# EAGLE design RAK3172_board (EAGLE 9.6.2)
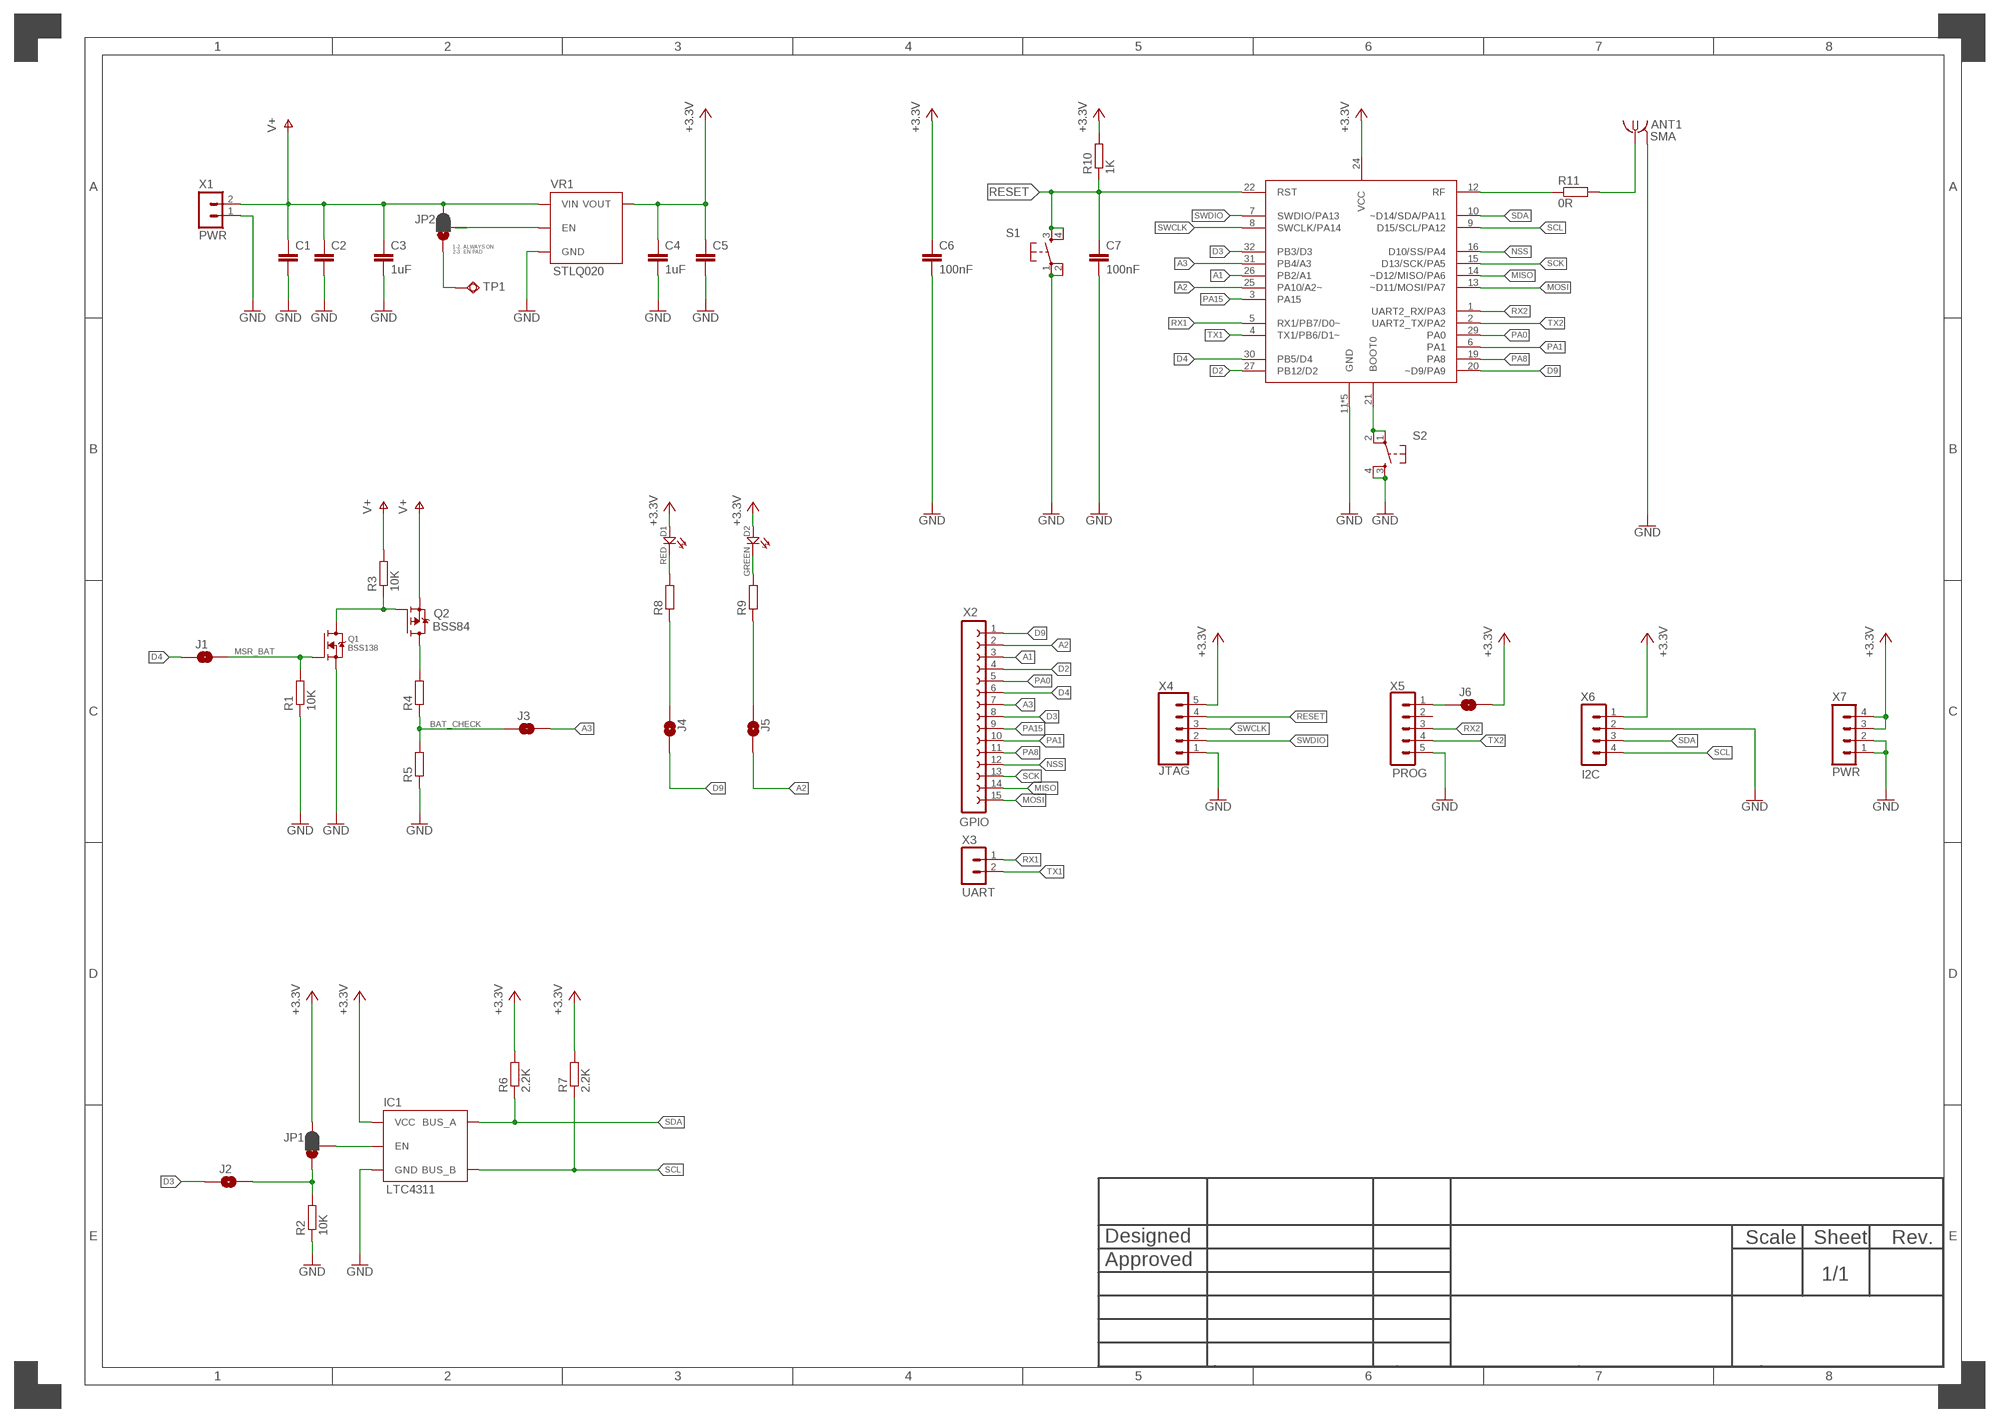
[diagram p0: schematic, sheet 1]

## Parts
ANT1  SMA  [SMA_1MM]
C1  CAP_CERAMIC_0603  [SMD_0603C]
C2  CAP_CERAMIC_0603  [SMD_0603C]
C3  1uF  CAP_CERAMIC_0603  [SMD_0603C]
C4  1uF  CAP_CERAMIC_0603  [SMD_0603C]
C5  CAP_CERAMIC_0603  [SMD_0603C]
C6  100nF  CAP_CERAMIC_0603  [SMD_0603C]
C7  100nF  CAP_CERAMIC_0603  [SMD_0603C]
D1  RED  LED0805  [LED-0805]
D2  GREEN  LED0805  [LED-0805]
IC1  LTC4311  [SC-70-6]
IC2  RAK3172HF  [RAK3172]
J1  SMD_JUMP_2_NO_N  [SMT_JUMP_2_NO]
J2  SMD_JUMP_2_NO_N  [SMT_JUMP_2_NO]
J3  SMD_JUMP_2_NO_N  [SMT_JUMP_2_NO]
J4  SMD_JUMP_2_NO_N  [SMT_JUMP_2_NO]
J5  SMD_JUMP_2_NO_N  [SMT_JUMP_2_NO]
J6  SMD_JUMP_2_NO_N  [SMT_JUMP_2_NO]
JP1  JUMPER-SMT_3_1-NC_PASTE_SILK  [SMT-JUMPER_3_1-NC_PASTE_SILK]
JP2  JUMPER-SMT_3_1-NC_PASTE_SILK  [SMT-JUMPER_3_1-NC_PASTE_SILK]
Q1  BSS138  [SOT-23-3]
Q2  BSS84  [SOT-23-3]
R1  10K  RESISTOR_0603  [SMD_0603]
R2  10K  RESISTOR_0603  [SMD_0603]
R3  10K  RESISTOR_0603  [SMD_0603]
R4  RESISTOR_0603  [SMD_0603]
R5  RESISTOR_0603  [SMD_0603]
R6  2.2K  RESISTOR_0603  [SMD_0603]
R7  2.2K  RESISTOR_0603  [SMD_0603]
R8  RESISTOR_0603  [SMD_0603]
R9  RESISTOR_0603  [SMD_0603]
R10  1K  RESISTOR_0603  [SMD_0603]
R11  0R  RESISTOR_0603  [SMD_0603]
S1  BTNRKB2  [RKB2]
S2  BTNRKB2  [RKB2]
TP1  PAD1.5X3.0  [PAD1.5X3.0]
VR1  STLQ020  [SOT323-5L]
X1  PWR  JST02_PH_H  [JST-PH_2]
X2  GPIO  CONN_15  [1X15]
X3  UART  CONN_02  [1X02]
X4  JTAG  CONN_05LOCK  [1X05_LOCK]
X5  PROG  JST05_2  [JST05_2MM]
X6  I2C  JST04_PH  [JST-PH_4]
X7  PWR  CONN_02X2  [2X02]

## Nets
+3V3: C4.1 C5.1 C6.1 D1.+ D2.+ IC1.P1(VCC) IC2.24(VCC) J6.2 JP1.3 R6.2 R7.2 R10.2 VR1.P$5(VOUT) X4.5 X6.1 X7.3 X7.4 ; supply symbol labelled +3.3V
A1: IC2.26(PB2/A1) X2.3
A2: IC2.25(PA10/A2~) J5.2 X2.2
A3: IC2.31(PB4/A3) J3.2 X2.7
AS: J4.1 R8.1
BAT_CHECK: J3.1 R4.1 R5.2
D2: IC2.27(PB12/D2) X2.4
D3: IC2.32(PB3/D3) J2.1 X2.8
D4: IC2.30(PB5/D4) J1.1 X2.6
D9: IC2.20(~D9/PA9) J4.2 X2.1
GND/2: ANT1.G@1(GND) ANT1.G@2(GND) ANT1.G@3(GND) ANT1.G@4(GND) C1.2 C2.2 C3.2 C4.2 C5.2 C6.2 C7.2 IC1.P2(GND) IC1.P5(GND) IC2.11(GND) IC2.17(GND) IC2.18(GND) IC2.23(GND) IC2.28(GND) Q1.2(S) R1.1 R2.1 R5.1 S1.1(P) S1.2(P1) S2.3(S) S2.4(S1) VR1.P$2(GND) X1.1 X4.1 X5.5 X6.2 X7.1 X7.2 ; supply symbol labelled GND
MISO: IC2.14(~D12/MISO/PA6) X2.14
MOSI: IC2.13(~D11/MOSI/PA7) X2.15
MSR_BAT: J1.2 Q1.1(G) R1.2
N$1: IC2.12(RF) R11.1
N$2: IC2.21(BOOT0) S2.1(P) S2.2(P1)
N$3: ANT1.1 R11.2
N$4: J6.1 X5.1
N$5: JP2.2 VR1.P$3(EN)
N$6: JP2.1 TP1.P$1
N$7: Q1.3(D) Q2.1(G) R3.1
N$8: D1.- R8.2
N$10: J2.2 JP1.1 R2.2
N$11: D2.- R9.2
N$12: Q2.3(D) R4.2
N$13: IC1.P3(EN) JP1.2
NSS: IC2.16(D10/SS/PA4) X2.12
PA0: IC2.29(PA0) X2.5
PA1: IC2.6(PA1) X2.10
PA8: IC2.19(PA8) X2.11
PA15: IC2.3(PA15) X2.9
QGWEG: J5.1 R9.1
RESET: C7.1 IC2.22(RST) R10.1 S1.3(S) S1.4(S1) X4.4
RX1: IC2.5(RX1/PB7/D0~) X3.1
RX2: IC2.1(UART2_RX/PA3) X5.3
SCK: IC2.15(D13/SCK/PA5) X2.13
SCL: IC1.P6(BUS_B) IC2.9(D15/SCL/PA12) R7.1 X6.4
SDA: IC1.P4(BUS_A) IC2.10(~D14/SDA/PA11) R6.1 X6.3
SWCLK: IC2.8(SWCLK/PA14) X4.3
SWDIO: IC2.7(SWDIO/PA13) X4.2
TX1: IC2.4(TX1/PB6/D1~) X3.2
TX2: IC2.2(UART2_TX/PA2) X5.4
V+: C1.1 C2.1 C3.1 JP2.3 Q2.2(S) R3.2 VR1.P$1(VIN) X1.2
Unconnected: X5.2

## Notes on the sheet
- 1-2: ALWAYS ON
  2-3: EN PAD

## Library data of the parts
ANT1 = RAK3172_board:SMA
C1-C7 = RAK3172_board:CAP_CERAMIC_*
D1 D2 = RAK3172_board:LED
IC1 = RAK3172_board:LTC4311
IC2 = RAK3172_board:RAK3172: RAK4260 LoRaWAN module from RAKwireless.
J1-J6 = RAK3172_board:SMD_JUMP_2_NO_
JP1 JP2 = RAK3172_board:JUMPER-SMT_3_1-NC_PASTE: Normally closed solder jumper (1 of 2 connections) This jumper has an aperture in the stencil to allow solder paste to bridge one of the two connections. One connection is normally closed (NC), while the other is normally open (NO). Wick off the solder to open the connection. Reapply solder to reclose the connection. Apply solder to the other side instead to change the current path.
Q1 = RAK3172_board:BSS138
Q2 = RAK3172_board:BSS84
R1-R11 = RAK3172_board:RESISTOR_*
S1 S2 = RAK3172_board:BTN
TP1 = RAK3172_board:PAD1.5X3.0
VR1 = RAK3172_board:STLQ020
X1 = RAK3172_board:JST02_*
X2 = RAK3172_board:CONN_15: FEMALE HEADER; OC_FARNELL: unknown; OC_NEWARK: unknown
X3 = RAK3172_board:CONN_02
X4 = RAK3172_board:CONN_05
X5 = RAK3172_board:JST05_*
X6 = RAK3172_board:JST04_*
X7 = RAK3172_board:CONN_02X2

## Board
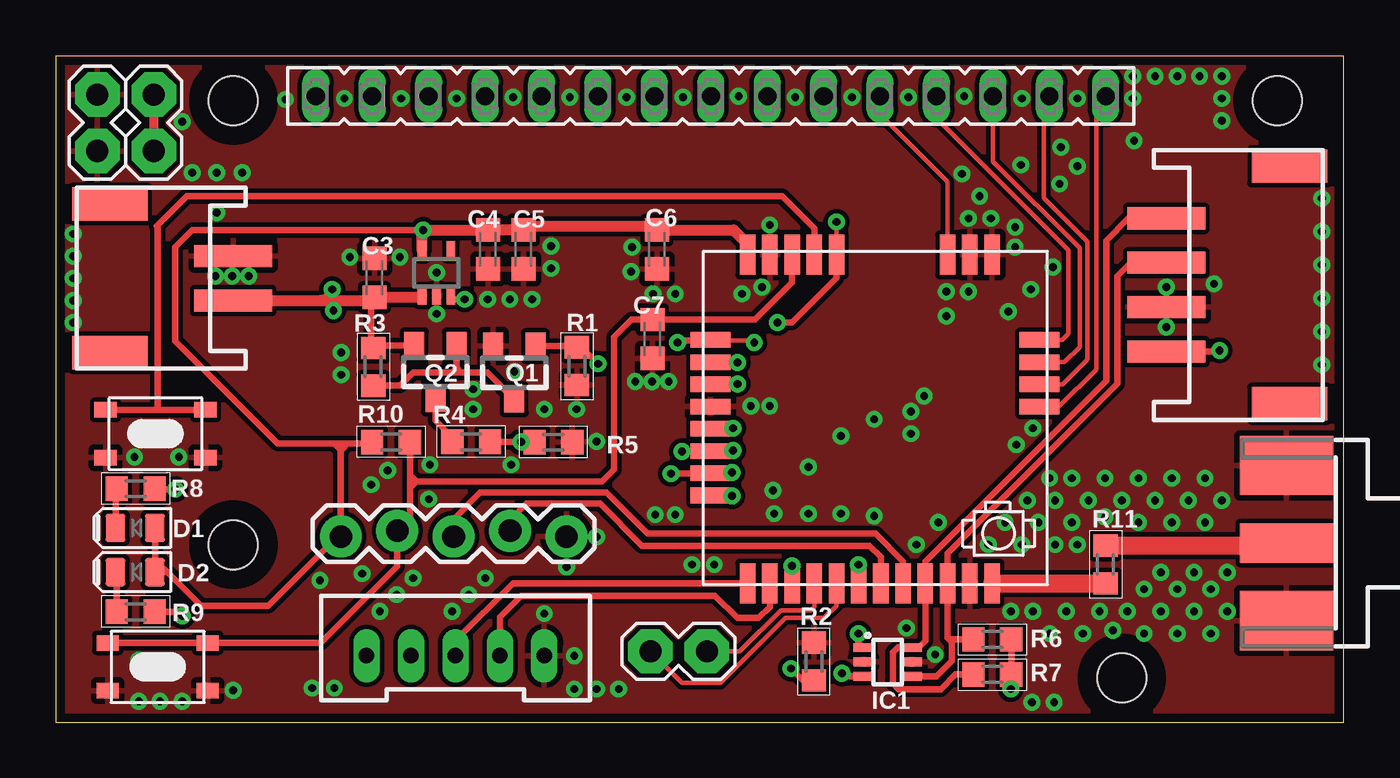
[diagram p1: board, top side]
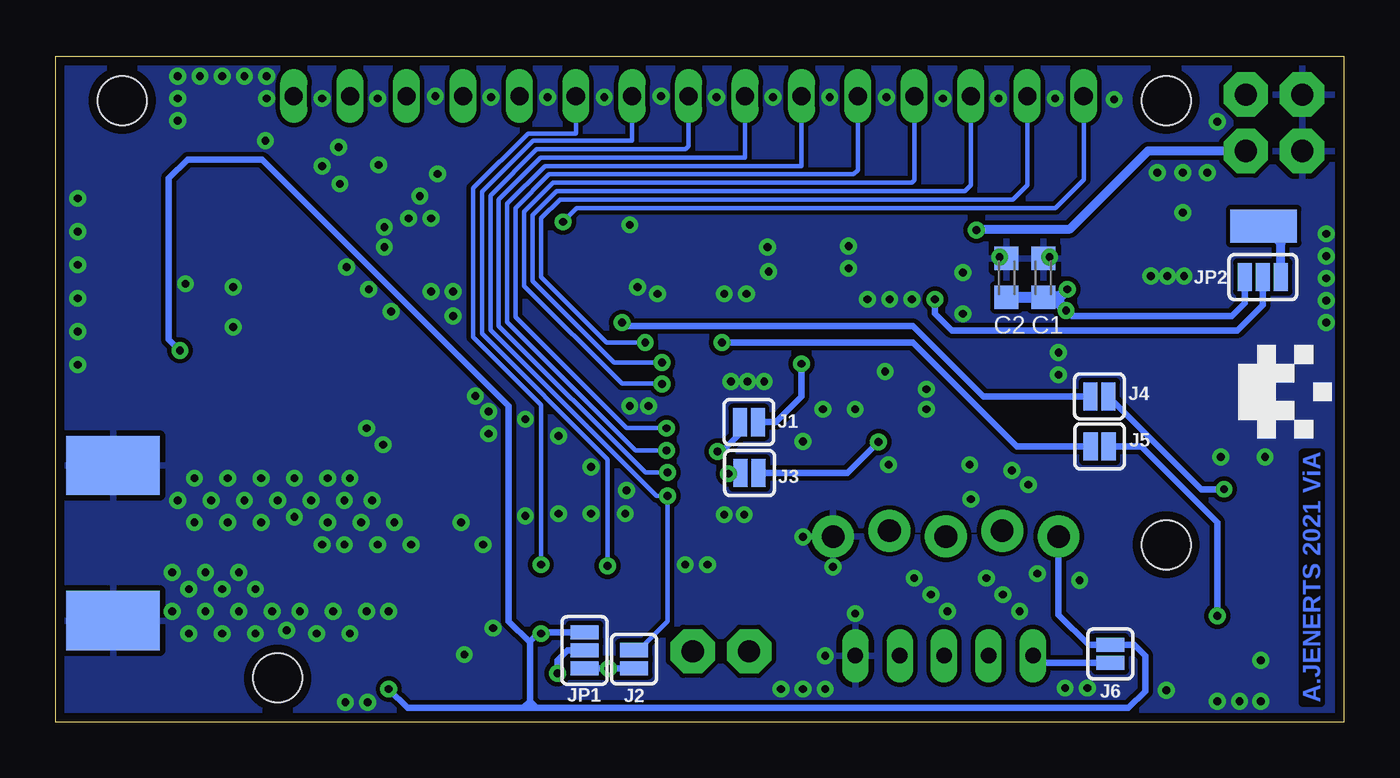
[diagram p2: board, bottom side, seen from below]

Size 58 x 30 mm. Coordinates in mm from the lower left corner, seen from the top.
Outline: 0,0 58,0 58,30 0,30 0,0
Copper layers (1*16): Top 0.035mm / dielectric 1.5mm / Bottom 0.035mm
Design rules "2layer_JLCPCB_2021_02": minimum track width 5mil, minimum drill 0.2mm, track to track 5mil, track to pad 0.2mm, pad to pad 5mil, via to via 0.2mm, smd to smd 0mil, copper to edge 0.4mm, drill to drill 10mil, minimum pad ring 3mil, minimum via ring 8mil, stop-mask expansion 4mil, vias tented up to drill 0.35mm, thermal gap 10mil
Holes 2.2 mm at 8,8 8,28 55,28 48,2
tRestrict: area 6.2,6.2 to 9.8,9.8; area 6.2,26.2 to 9.8,29.8; area 53.2,26.2 to 56.8,29.8; area 46.2,0.2 to 49.8,3.8

### Footprints (pad centres in the part's own frame; a part is rotated, then mirrored left to right if it is on the bottom)
SMA_1MM = smd 4.191 x 1.778: 1 2.115,0 | smd 4.191 x 2.667: G@1 2.115,3.495; G@2 2.115,-3.495 | smd 4.191 x 2.667 bottom: G@3 2.115,3.495; G@4 2.115,-3.495
SMD_0603C = smd 1.05 x 1.08: 1 -0.875,0; 2 0.875,0
LED-0805 = smd 0.889 x 1.27: + 0.889,0; - -0.889,0
SC-70-6 = smd 0.9 x 0.4: P1 -1.1,0.65; P2 -1.1,0; P3 -1.1,-0.65; P4 1.1,-0.65; P5 1.1,0; P6 1.1,0.65
RAK3172 = smd 0.7 x 1.8: 1 13.5,14.945; 2 12.5,14.945; 3 11.5,14.945; 4 10.5,14.945; 5 9.5,14.945; 6 8.5,14.945; 7 7.5,14.945; 8 6.5,14.945; 9 5.5,14.945; 10 4.5,14.945; 11 3.5,14.945; 12 2.5,14.945; 17 2.5,0.145; 18 3.5,0.145; 19 4.5,0.145; 20 9.5,0.145; 21 10.5,0.145; 22 11.5,0.145; 23 12.5,0.145; 24 13.5,0.145 | smd 1.8 x 0.7: 13 0.365,6.99; 14 0.365,5.99; 15 0.365,4.99; 16 0.365,3.99; 25 15.165,3.99; 26 15.165,4.99; 27 15.165,5.99; 28 15.165,6.99; 29 15.165,7.99; 30 15.165,8.99; 31 15.165,9.99; 32 15.165,10.99
SMT_JUMP_2_NO = smd 0.635 x 1.27: 1 -0.406,0; 2 0.406,0
SMT-JUMPER_3_1-NC_PASTE_SILK = smd 0.635 x 1.27: 1 -0.813,0; 2 0,0; 3 0.813,0
SOT-23-3 = smd 0.9 x 1.2: 1 -0.95,-1.2; 2 0.95,-1.2; 3 0,1.2
SMD_0603 = smd 1 x 1.1: 1 -0.85,0; 2 0.85,0
RKB2 = smd 1 x 0.7: 1 -2.25,1.075; 2 2.25,1.075; 3 -2.25,-1.075; 4 2.25,-1.075
PAD1.5X3.0 = smd 3 x 1.5: P$1 0,0
SOT323-5L = smd 0.4 x 0.8: P$1 -0.65,-1.025; P$2 0,-1.025; P$3 0.65,-1.025; P$4 0.65,1.025; P$5 -0.65,1.025
JST-PH_2 = smd 1 x 3.5: 1 1,0; 2 -1,0 | smd 1.5 x 3.4: P1 3.35,5.55; P2 -3.35,5.55
1X15 = drill 0.813 long: 1 -17.78,0; 2 -15.24,0; 3 -12.7,0; 4 -10.16,0; 5 -7.62,0; 6 -5.08,0; 7 -2.54,0; 8 0,0; 9 2.54,0; 10 5.08,0; 11 7.62,0; 12 10.16,0; 13 12.7,0; 14 15.24,0; 15 17.78,0
1X02 = drill 1 pad 2 octagon: 1 -1.27,0; 2 1.27,0
1X05_LOCK = drill 1.016 pad 1.88: 1 0,0.127; 2 2.54,-0.127; 3 5.08,0.127; 4 7.62,-0.127; 5 10.16,0.127
JST05_2MM = drill 0.7 pad 1.2 long: 1 -4,0; 2 -2,0; 3 0,0; 4 2,0; 5 4,0
JST-PH_4 = smd 1 x 3.5: 1 3,0; 2 1,0; 3 -1,0; 4 -3,0 | smd 1.5 x 3.4: P1 5.35,5.55; P2 -5.35,5.55
2X02 = drill 1 pad 2 octagon: 1 -1.27,1.27; 2 1.27,1.27; 3 -1.27,-1.27; 4 1.27,-1.27

### Placement (x,y rotation side)
ANT1  57.53,8.07 180 top
C1  13.54,20.02 90 bottom
C2  15.19,20.02 90 bottom
C3  14.35,20.02 90 top
C4  19.46,21.3 270 top
C5  21.06,21.3 270 top
C6  27.07,21.3 270 top
C7  26.87,17.26 270 top
D1  3.59,8.76 0 top
D2  3.59,6.77 0 top
IC1  37.46,2.72 0 top
IC2  44.66,21.21 180 top
J1  26.79,13.52 0 bottom
J2  31.96,2.85 270 bottom
J3  26.76,11.23 180 bottom
J4  11.01,14.68 180 bottom
J5  11,12.43 180 bottom
J6  10.52,3.09 90 bottom
JP1  34.19,3.24 90 bottom
JP2  3.65,20.05 180 bottom
Q1  20.65,15.75 180 top
Q2  17.1,15.78 180 top
R1  23.47,16.04 90 top
R2  34.14,2.74 270 top
R3  14.3,16.01 90 top
R4  18.71,12.63 180 top
R5  22.41,12.62 180 top
R6  42.17,3.74 0 top
R7  42.17,2.16 0 top
R8  3.61,10.52 180 top
R9  3.61,4.98 180 top
R10  15.1,12.62 180 top
R11  47.26,7.11 90 top
S1  4.6,2.5 180 top
S2  4.5,13 0 top
TP1  3.61,22.35 0 bottom
U$3  [A.JENERTS_5MM]  2.65,14.9 90 bottom
VR1  17.15,20.25 0 top
X1  8,20 90 top
X2  29.5,28.2 0 top
X3  28.05,3.2 0 top
X4  23,8.5 180 top
X5  18,3 0 top
X6  50,19.7 270 top
X7  3.15,27 90 top

### Tracks (layer width: path | path; a pad name or v marks a point on that pad's centre or on a via)
+3V3  (via drill 0.35)
  Top 0.3: v16.55,22.17 6.16,22.17 5.38,21.4 5.38,17.17 10,12.55 12.55,12.55 | 14.05,12.62 R10.2 14.18,12.55 13.15,12.55 | IC1.P1 36.15,3.58 v36.15,4 | R6.2 R7.2 43.02,1.52 v43,1.5 | v52.4,16.75 52.35,16.7 X6.1 | 12.55,12.55 12.8,12.55 | 12.8,12.55 13.15,12.55 | D1.+ 4.48,7.1 | 4.48,7.1 D2.+ 5.03,6.77 | 5.03,6.77 6.55,5.25 9.57,5.25 12.69,8.37 X4.5 12.84,12.26 | 12.84,12.26 12.84,12.51 12.8,12.55 | 12.84,12.26 12.8,12.3 | 12.55,12.55 12.8,12.3 | 12.8,12.3 12.9,12.3 13.15,12.55 | 5.03,6.77 4.7,7.1 4.48,7.1
  Top 0.4: X7.4 X7.3
  Top 0.5: IC2.24 31.2,21.11 31.2,21.5 30.53,22.17 C6.1 26.92,22.32 21.21,22.32 C5.1 C4.1 v16.55,22.17 16.5,22.12 VR1.P$5
  Bottom 0.3: X4.5 12.85,4.85 11.49,3.49 J6.2 9.44,3.49 8.95,3 8.95,1.4 9.7,0.65 36.35,0.65 | 36.35,0.65 36.65,0.95 | 36.65,0.95 36.65,3.6 | 36.65,3.6 36.65,3.65 36.3,4 v36.15,4 36.1,4.05 JP1.3 | v43,1.5 42.15,0.65 36.95,0.65 | 36.95,0.65 36.35,0.65 | 36.65,0.95 36.95,0.65 | 36.65,3.6 37.6,4.55 37.6,14.25 48.7,25.35 52.05,25.35 52.9,24.5 52.9,17.25 v52.4,16.75
  Bottom 0.4: X7.3 8.82,25.73 12.33,22.22 16.5,22.22 v16.55,22.17
A1  (via drill 0.35)
  Top 0.2: IC2.26 30.68,16.22 v30.7,16.2
  Bottom 0.2: X2.3 16.8,24.2 17.07,23.93 35.44,23.93 36.53,22.84 36.53,19.86 32.86,16.2 v30.7,16.2
A2  (via drill 0.35)
  Top 0.2: v31.45,17.1 31.35,17.2 29.51,17.2 IC2.25
  Top 0.3: v28,17.1 28.1,17.2 29.47,17.2 IC2.25
  Bottom 0.2: X2.2 14.26,24.19 14.9,23.55 35.3,23.55 36.15,22.7 36.15,20.05 33.2,17.1 v31.45,17.1
  Bottom 0.3: v28,17.1 19.4,17.1 14.73,12.43 J5.2
A3  (via drill 0.35)
  Top 0.3: v27.7,11.2 27.72,11.22 IC2.31 30.42,11.22 v30.45,11.25
  Bottom 0.2: X2.7 26.96,25.43 36.16,25.43 38.05,23.54 38.05,17.85 31.45,11.25 v30.45,11.25
  Bottom 0.3: J3.2 27.67,11.23 v27.7,11.2
AS  (via drill 0.35)
  Top 0.3: v5.4,10.5 4.48,10.5 R8.1
  Bottom 0.3: J4.1 6.42,10.5 v5.4,10.5
BAT_CHECK  (via drill 0.35)
  Top 0.3: R4.1 v20.95,12.63 v20.96,12.62 R5.2
  Bottom 0.3: v20.95,12.63 22.35,11.23 J3.1
D2  (via drill 0.35)
  Top 0.2: IC2.27 30.68,15.22 v30.7,15.24
  Bottom 0.2: X2.4 19.34,24.41 19.45,24.3 35.6,24.3 36.9,23 36.9,19.65 32.5,15.25 v30.7,15.25 v30.7,15.24
D3  (via drill 0.35)
  Top 0.2: v30.45,10.2 29.51,10.2 IC2.32
  Bottom 0.2: J2.1 31.74,3.26 30.45,4.55 v30.45,10.2 v30.46,10.19 30.95,10.19 38.43,17.66 38.43,23.72 36.34,25.81 29.65,25.81 29.5,25.96 X2.8
D4  (via drill 0.35)
  Top 0.3: v28.2,12.2 28.22,12.22 IC2.30 30.47,12.22 v30.5,12.25
  Bottom 0.2: X2.6 24.42,25.05 35.97,25.05 37.67,23.35 37.67,18.02 31.9,12.25 v30.5,12.25
  Bottom 0.3: v28.2,12.2 28,12.2 27.2,13 J1.1
D9  (via drill 0.35)
  Top 0.2: IC2.20 v35.15,22.54
  Top 0.3: v32.5,18 33.14,18 35.16,20.01 IC2.20
  Bottom 0.2: X2.1 11.72,24.43 13,23.15 34.54,23.15 v35.15,22.54
  Bottom 0.3: v32.5,18 32.35,17.85 19.4,17.85 16.52,14.97 16.23,14.68 J4.2
GND/2  (via drill 0.35)
  other vias: 8.7,20.1 7.95,20.1 7.2,20.1 13.25,20.95 15.5,20.95 17.15,20.25 19.45,19.05 20.45,19.05 21.45,19.05 17.15,18.4 25.95,21.4 26.85,15.35 26.1,15.35 27.6,15.35 23.45,14.1 20.65,15.8 22,14.1 18.8,15 18.8,14.1 12.85,16.65 12.85,15.65 3.55,11.95 5.55,11.95 22,4.9 23.35,3 17.85,5 18.6,5.75 19.35,6.5 14.6,5 15.35,5.75 16.1,6.5 13.8,6.7 11.9,6.4 12.55,1.55 14.95,11.35 14.2,10.7 16.8,10.05 16.85,11.6 20.5,11.6 24.35,12.65 27,9.35 27.9,9.35 29.65,7.1 28.65,7.1 24.35,8.35 23,7 38.3,4.25 39.6,3.05 44,5 45.5,5 44.75,4 46.25,4 47,5 48.25,5 49,4 49,6 49.75,5 50.5,4 52,4 51.25,5 52.75,5 50.5,6 52,6 49.75,6.75 51.25,6.75 52.75,6.75 42,8 43.5,8 45,8 42.75,9 44.25,9 45.75,9 45,10 46.5,10 48,10 49.5,10 51,10 52.5,10 48.75,9 50.25,9 51.75,9 47.25,9.25 43,5 43.75,10 45.75,11 47.25,11 48.75,11 50.25,11 51.75,11 44.75,11 46,8 38.75,8 39.75,9 44,13.25 43.25,12.5 38.5,14 38.5,13 39.1,14.7 33.9,11.5 32.3,10.45 40.1,19.4 40.1,18.3 41.1,22.7 42.1,22.7 41.6,23.7 40.8,24.7 43.2,22.3 41.1,19.4 43.2,21.4 44.9,20.5 43.9,19.5 42.9,18.5 50,17.8 50,19.6 52.15,19.75 52.5,28.1 52.5,29.1 51.5,29.1 52.5,27.1 57,16.1 57,17.6 57,19.1 57,20.6 57,22.1 57,23.6 48.5,29.1 49.5,29.1 50.5,29.1 48.5,28.1 46,28.1 43.5,28.1 40.9,28.2 35.85,28.15 38.4,28.15 33.3,28.15 30.75,28.2 28.25,28.15 25.7,28.15 23.15,28.15 20.6,28.15 18.05,28.1 15.55,28.1 13,28.1 32.15,22.4 7.25,22.95 0.8,18 0.8,19 0.8,20 0.8,21 0.8,22 36.85,9.3 36.85,13.65 35.35,12.9 33.9,9.4 35.35,9.4 32.35,9.4 31.3,14.25 32.15,14.25 43.45,25.1 45.2,24.25 46,25.05 45.25,25.9 48.55,26.2 7.25,24.75 6.15,24.75 8.4,24.75 11.55,1.55 3.75,0.95 5.7,0.95 23.35,1.5 24.35,1.5 25.35,1.5 4.7,0.95 3.75,2.8 30.9,19.3 31.8,19.6 27.9,19.3 26.9,19.3 22.3,20.45 22.3,21.45 25.9,20.3 47.6,4.15 8,1.45 43.95,0.9 44.95,0.9 10.35,28.05 5.7,27.05
  pour Bottom (isolate 0.2): 0,0 0,30.4 58.8,30.4 58.8,0
  pour Top (isolate 0.2): 0,0 0,30 58,30 58,0
MISO
  Top 0.2: IC2.14 45.32,15.22 46.45,16.35 46.45,21.65 44.49,23.61 44.49,27.95 X2.14
MOSI
  Top 0.2: IC2.13 45.17,14.22 46.85,15.9 46.85,27.77 X2.15
MSR_BAT  (via drill 0.35)
  Top 0.3: Q1.1 23.41,16.95 R1.2 23.68,16.89 v24.42,16.15
  Bottom 0.3: v24.42,16.15 24.42,14.68 25.58,13.52 J1.2
N$1
  Top 0.5: R11.1 arc-90 R11.1
  Top 0.813: IC2.12 R11.1
N$2
  Top 0.3: 4.6,22.4 5.9,23.7 32.7,23.7 34.16,22.24 IC2.21 | 4.6,22.4 4.55,22.35 | S2.1 4.5,14.07 | 4.5,14.07 S2.2 | 4.6,22.4 4.6,14.18 4.5,14.07
N$3
  Top 0.5: 55.3,7.96 arc-90 ANT1.1
  Top 0.813: R11.2 55.3,7.96
N$4
  Bottom 0.3: J6.1 13.68,2.68 X5.1
N$5  (via drill 0.35)
  Top 0.3: VR1.P$3 17.97,19.05 v18.41,19.05
  Bottom 0.3: JP2.2 3.65,18.8 4.8,17.65 17.65,17.65 18.41,18.41 v18.41,19.05
N$6
  Bottom 0.4: JP2.1 2.84,21.57 TP1.P$1
N$7
  Top 0.3: R3.1 15.51,15.16 16.1,15.75 17.85,15.75 | 17.85,15.75 18.05,15.95 | 18.05,15.95 Q2.1 | Q1.3 19.45,15.75 18.2,15.75 | 18.2,15.75 17.85,15.75 | 18.05,15.95 18.2,15.8 18.2,15.75
N$8
  Top 0.3: D1.- 2.7,10.46 R8.2
N$10  (via drill 0.35)
  Top 0.3: R2.2 33.64,1.89 v33.1,2.43
  Bottom 0.3: JP1.1 v33.1,2.43 31.98,2.43 J2.2
N$11
  Top 0.3: D2.- 2.76,6.71 R9.2
N$12
  Top 0.3: Q2.3 17.1,13.59 17.86,12.83 R4.2
N$13  (via drill 0.35)
  Top 0.3: IC1.P3 35.54,2.07 v35.41,2.21
  Bottom 0.3: v35.41,2.21 35.41,2.79 34.96,3.24 JP1.2
NSS
  Top 0.2: IC2.16 45.29,17.22 45.59,17.52 45.59,21.26 39.65,27.2 X2.12
PA0  (via drill 0.35)
  Top 0.3: IC2.29 30.47,13.22 v30.5,13.25
  Bottom 0.2: X2.5 21.88,24.87 22.07,24.68 35.78,24.68 37.3,23.17 37.3,18.25 32.3,13.25 v30.5,13.25
PA1  (via drill 0.35)
  Top 0.2: IC2.6 v36.16,7.09 v36.15,7.1
  Bottom 0.2: v36.15,7.1 36.15,14.3 39.2,17.35 39.2,24.05 36.74,26.51 34.6,26.51 34.58,26.53 X2.10
PA8
  Top 0.2: IC2.19 40.16,24.34 37.12,27.38 X2.11
PA15  (via drill 0.35)
  Top 0.2: IC2.3 v33.16,7.04 v33.15,7.05
  Bottom 0.2: v33.15,7.05 33.15,11.85 38.8,17.5 38.8,23.9 36.52,26.18 32.04,26.18 X2.9
QGWEG  (via drill 0.35)
  Top 0.3: v5.7,4.8 5.52,4.98 R9.1
  Bottom 0.3: J5.1 9.13,12.43 5.7,9 v5.7,4.8
RESET
  Top 0.3: IC2.22 33.16,19.81 31.49,18.14 C7.1 25.94,18.14 25.15,17.35 25.15,11.4 24.6,10.85 16.25,10.85 | S1.4 S1.3 11.93,3.58 15.38,7.03 X4.4 15.95,9.28 15.95,10.55 | 15.95,10.55 15.95,10.85 | 15.95,10.85 15.95,11.15 | R10.1 15.95,11.15 | 16.25,10.85 15.95,11.15 | 16.25,10.85 15.95,10.85 | 16.25,10.85 15.95,10.55
RX1
  Top 0.2: IC2.5 35.16,5.26 34.6,4.7 32.85,4.7 29.93,1.77 28.2,1.77 X3.1
RX2
  Top 0.3: X5.3 17.99,3.66 20.59,6.26 IC2.1
SCK
  Top 0.2: IC2.15 45.42,16.22 46.1,16.9 46.1,21.35 42.2,25.25 X2.13
SCL
  Top 0.3: R7.1 40.51,2.16 39.85,1.5 37.95,1.5 37.7,1.75 37.7,3.15 37.92,3.37 IC1.P6 38.86,3.37 39.16,3.67 IC2.9 39.16,7.26 47.3,15.4 47.3,21.7 48.3,22.7 X6.4
SDA
  Top 0.3: IC1.P4 39.66,2.07 40.36,2.77 40.36,3.61 40.16,3.81 IC2.10 | IC2.10 40.16,3.81 40.23,3.74 R6.1 | IC2.10 40.16,7.61 47.8,15.25 47.8,20.1 48.4,20.7 X6.3
SWCLK
  Top 0.3: IC2.8 38.16,7.24 36.9,8.5 26.65,8.5 24.8,10.35 19.12,10.35 17.96,9.19 X4.3
SWDIO
  Top 0.3: IC2.7 37.16,7.44 36.65,7.95 26.41,7.95 24.5,9.85 21.2,9.85 20.5,9.15 X4.2
TX1
  Top 0.2: IC2.4 34.16,5.21 34,5.05 32.65,5.05 30.8,3.2 X3.2
TX2
  Top 0.3: X5.4 20,4.75 20.95,5.71 29.7,5.71 30.7,4.7 31.65,4.7 32.16,5.21 IC2.2
V+  (via drill 0.35)
  Top 0.3: 14.2,19 14.2,16.96 R3.2 14.42,16.98 Q2.2
  Top 0.5: 14.38,19.12 16.4,19.12 VR1.P$1 | C3.1 14.38,19.12 | 14.38,19.12 arc-90 14.25,19 14.2,19 X1.2 11.95,19 arc90 v12.45,19.5
  Bottom 0.3: JP2.3 4.46,18.89 5.05,18.3 12.26,18.3 v12.51,18.55
  Bottom 0.5: C2.1 C1.1 12.8,19.14 | v12.45,19.5 12.8,19.14 | 12.8,19.14 12.96,19 v12.51,18.55

### Text on the board
Bottom: A.JENERTS 2021 ViA
tSilk: RAK3172
_tsilk: + | D9 | A2 | A1 | D2 | D9 | D4 | A3 | D3 | PA15 | PA1 | PA8 | NSS | SCK | MI | MO | SCL | SDA | + | 3V3 | BOOT | 3V3 | RST | CLK | DIO | 3V3 | NC | RXD | TXD | RX1 | TX1 | RESET